# Altium project KiralyKrisztina17.PrjPcb
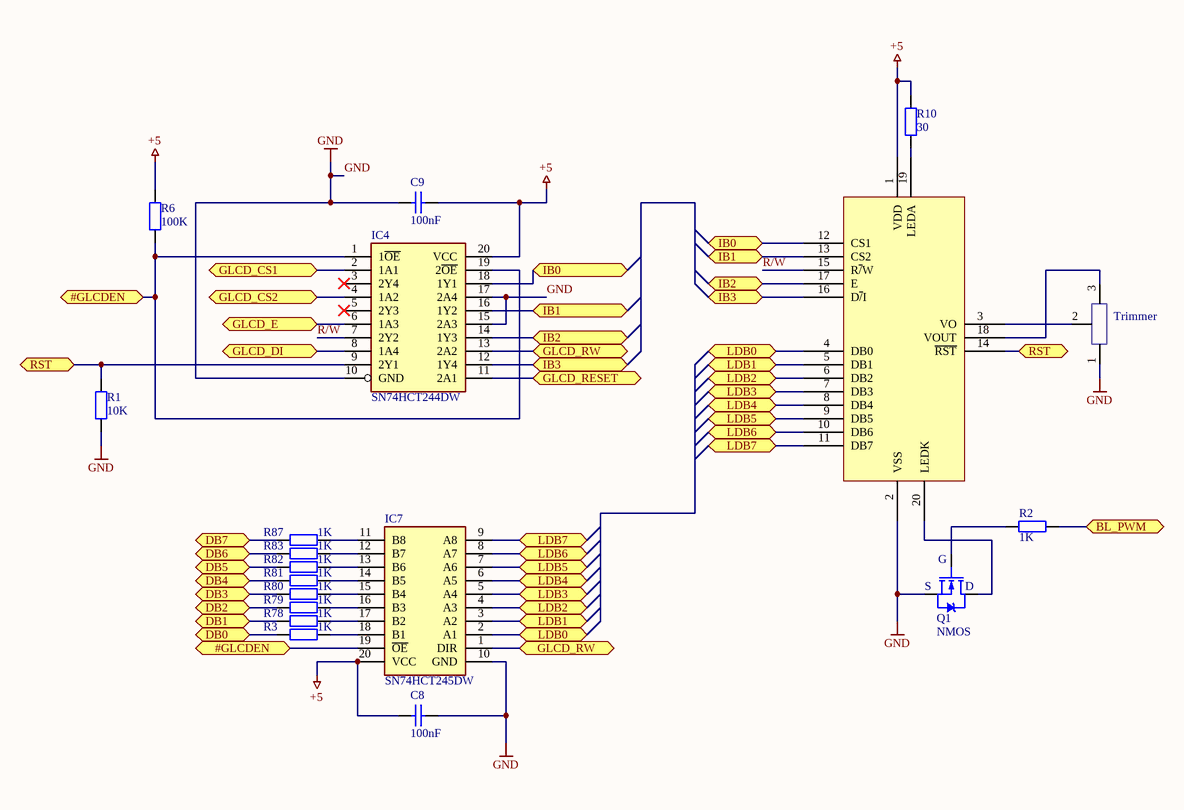
[diagram p0: LCD_screen.SchDoc]
4 sheets, 27 parts. Net scope: flat (ports and power ports of the same name join across sheets).
Board file: F17_Kiraly_Krisztina.PcbDoc
Sheets:
  LCD_screen.SchDoc
  Buttons.SchDoc
  Nucleo.SchDoc
  Power.SchDoc

## Sheet LCD_screen.SchDoc: LCD illeszteszése
size A4; Author: Király Krisztina; Organization: BME-AUT; DocumentNumber: 1; Revision: 17; SheetNumber: 1; SheetTotal: 4

### Parts
BC817  LCD Screen  [FP_LCD]  (value not drawn)
C8  100nF  [FP_0805_CAP_085]
C9  100nF  [FP_0805_CAP_085]
IC4  SN74HCT244DW  [SOIC127P1030X265-20N]
IC7  SN74HCT245DW  [SOIC127P1030X265-20N]
Q1  NMOS  [FP_SOT23-3]
R1  10K  [FP_0805_RES]
R2  1K  [FP_0805_RES]
R3  1K  [FP_0805_RES]
R6  100K  [FP_0805_RES]
R10  30  [FP_0805_RES]
R78  1K  [FP_0805_RES]
R79  1K  [FP_0805_RES]
R80  1K  [FP_0805_RES]
R81  1K  [FP_0805_RES]
R82  1K  [FP_0805_RES]
R83  1K  [FP_0805_RES]
R87  1K  [FP_0805_RES]
Trimmer  (no value)  [TRIM_3362P-1-502]

### Ports
#GLCDEN (bidir), BL_PWM (bidir), DB0 (bidir), DB1 (bidir), DB2 (bidir), DB3 (bidir), DB4 (bidir), DB5 (bidir), DB6 (bidir), DB7 (bidir), GLCD_CS1 (bidir), GLCD_CS2 (bidir), GLCD_DI (bidir), GLCD_E (bidir), GLCD_RESET (bidir), GLCD_RW (bidir), IB0 (bidir), IB1 (bidir), IB2 (bidir), IB3 (bidir), LDB0 (bidir), LDB1 (bidir), LDB2 (bidir), LDB3 (bidir), LDB4 (bidir), LDB5 (bidir), LDB6 (bidir), LDB7 (bidir), RST (bidir)

### Nets
+5: BC817.1(VDD) C8.1 C9.2 IC4.20(VCC) IC7.20(VCC) R6.2 R10.2
GND: BC817.2(VSS) C8.2 C9.1 IC4.10(GND) IC4.15(2A3) IC4.17(2A4) IC7.10(GND) Q1.3(S) R1.1 Trimmer.1
R/W: BC817.15(R~{/}W) IC4.7(2Y2)
NetBC817_3: BC817.3(VO) Trimmer.2
NetBC817_4: BC817.4(DB0) IC7.2(A1) ; port LDB0
NetBC817_5: BC817.5(DB1) IC7.3(A2) ; port LDB1
NetBC817_6: BC817.6(DB2) IC7.4(A3) ; port LDB2
NetBC817_7: BC817.7(DB3) IC7.5(A4) ; port LDB3
NetBC817_8: BC817.8(DB4) IC7.6(A5) ; port LDB4
NetBC817_9: BC817.9(DB5) IC7.7(A6) ; port LDB5
NetBC817_10: BC817.10(DB6) IC7.8(A7) ; port LDB6
NetBC817_11: BC817.11(DB7) IC7.9(A8) ; port LDB7
NetBC817_12: BC817.12(CS1) IC4.18(1Y1) ; port IB0
NetBC817_13: BC817.13(CS2) IC4.16(1Y2) ; port IB1
NetBC817_14: BC817.14(~{RST}) IC4.9(2Y1) R1.2 ; port RST
NetBC817_16: BC817.16(D~{/}I) IC4.12(1Y4) ; port IB3
NetBC817_17: BC817.17(E) IC4.14(1Y3) ; port IB2
NetBC817_18: BC817.18(VOUT) Trimmer.3
NetBC817_19: BC817.19(LEDA) R10.1
NetBC817_20: BC817.20(LEDK) Q1.2(D)
NetIC4_1: IC4.1(1~{OE}) IC4.19(2~{OE}) IC7.19(~{OE}) R6.1 ; port #GLCDEN
NetIC4_2: IC4.2(1A1) ; port GLCD_CS1
NetIC4_4: IC4.4(1A2) ; port GLCD_CS2
NetIC4_6: IC4.6(1A3) ; port GLCD_E
NetIC4_8: IC4.8(1A4) ; port GLCD_DI
NetIC4_11: IC4.11(2A1) ; port GLCD_RESET
NetIC4_13: IC4.13(2A2) IC7.1(DIR) ; port GLCD_RW
NetIC7_11: IC7.11(B8) R87.2
NetIC7_12: IC7.12(B7) R83.2
NetIC7_13: IC7.13(B6) R82.2
NetIC7_14: IC7.14(B5) R81.2
NetIC7_15: IC7.15(B4) R80.2
NetIC7_16: IC7.16(B3) R79.2
NetIC7_17: IC7.17(B2) R78.2
NetIC7_18: IC7.18(B1) R3.2
NetQ1_1: Q1.1(G) R2.1
NetR2_2: R2.2 ; port BL_PWM
NetR3_1: R3.1 ; port DB0
NetR78_1: R78.1 ; port DB1
NetR79_1: R79.1 ; port DB2
NetR80_1: R80.1 ; port DB3
NetR81_1: R81.1 ; port DB4
NetR82_1: R82.1 ; port DB5
NetR83_1: R83.1 ; port DB6
NetR87_1: R87.1 ; port DB7

Not connected (* = marked no-connect by the designer): IC4 3(2Y4)* 5(2Y3)*

### Notes on the sheet
- (near Q1) S
- (near Q1) G
- (near Q1) D
- Title
- Size:
- Date:
- A4
- Number:
- Time:
- Revision:
- Sheet
- of
- File:

### Library data of the parts
BC817 = LCD Screen: Reference: TME; Name: RG12864A-BIW-V; Supplier: Tanszék
C8 C9 = CAP: Capacitor; Name: 100nF 0805 10% 50V X7R 0805B104K500NT (FNG); Supplier: Lomex; Reference: 82-13-46; Value: 100nF
IC4 = SN74HCT244DW: Integrated Circuit; Manufacturer_Name: Texas Instruments; Name: TEXAS INSTRUMENTS SN74HCT244DWR; Reference: 3006172; Datasheet Link: http://www.ti.com/lit/ds/symlink/sn74hct244.pdf; Height: 2.65mm; Manufacturer_Part_Number: SN74HCT244DW; Mouser Part Number: 595-SN74HCT244DW; Mouser Price/Stock: https://www.mouser.co.uk/ProductDetail/Texas-Instruments/SN74HCT244DW?qs=8yeEWhuAOtPaf02S2l6zdA%3D%3D; Arrow Part Number: SN74HCT244DW; Arrow Price/Stock: https://www.arrow.com/en/products/sn74hct244dw/texas-instruments?region=nac; Supplier: Farnell
IC7 = SN74HCT245DW: Integrated Circuit; Manufacturer_Name: Texas Instruments; Name: 74HCT245D (NXP) 8xBIDIRECTIONAL BUS TRANSCEIVER 3-STATE OUTPUT SO-20 WIDE; Datasheet Link: http://www.ti.com/lit/ds/symlink/sn74hct245.pdf; Height: 2.65mm; Manufacturer_Part_Number: SN74HCT245DW; Mouser Part Number: 595-SN74HCT245DW; Mouser Price/Stock: https://www.mouser.co.uk/ProductDetail/Texas-Instruments/SN74HCT245DW?qs=5h8QSfodyRguwsnqzMvAgw%3D%3D; Arrow Part Number: SN74HCT245DW; Arrow Price/Stock: https://www.arrow.com/en/products/sn74hct245dw/texas-instruments?region=nac; Supplier: Lomex; Reference: 87-06-35
Q1 = NMOS: NXP - BSP030,115 - MOSFET, N CH, 30V, 10A, SOT223; pin to pad: 2>3 3>2; Name: 2N7002 (NXP) N-FET 60V 0.3A 0.83W Rds<5R SOT-23 ˝12W˝ (SN7002); Supplier: Lomex; Reference: 86-00-97
R1 = RES: Resistor; Name: 10K0 0805 5% RS-05K103JT 0.125W (FNG); Supplier: Lomex; Reference: 81-35-05; Value: 10K
R2 R3 R78-R83 R87 = RES: Resistor; Name: 1K00 0805 5% CR-05JL7----1K 0.125W (VIK); Supplier: Lomex; Reference: 81-10-87; Value: 1K
R6 = RES: Resistor; Name: 100K 0805 5% CR-05JL7--100K 0.125W (VIK); Supplier: Lomex; Reference: 81-11-11; Value: 100K
R10 = RES: Resistor; Name: 30R0 0805 5% WR08X300JTL 0.125W (WAL); Supplier: Lomex; Reference: 81-29-89; Value: 30
Trimmer = Trimmer: Name: 5K00 3362P-502R (KIC) 6.6x7mm 1#-1# CERMET FEKVÖ; Supplier: Lomex; Reference: 05-06-68; Max value: *; Min value: *

## Sheet Buttons.SchDoc: Gomb illesztések
size A4; DocumentNumber: 2; SheetNumber: 2; SheetTotal: 4
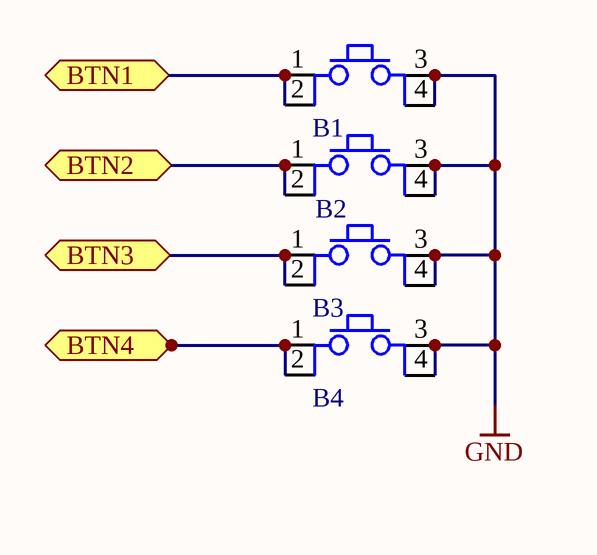
[diagram p1: Buttons.SchDoc]

### Parts
B1  Button  [FP_BTN_SMD]  (value not drawn)
B2  Button  [FP_BTN_SMD]  (value not drawn)
B3  Button  [FP_BTN_SMD]  (value not drawn)
B4  Button  [FP_BTN_SMD]  (value not drawn)

### Ports
BTN1 (bidir), BTN2 (bidir), BTN3 (bidir), BTN4 (bidir)

### Nets
GND: B1.3 B1.4 B2.3 B2.4 B3.3 B3.4 B4.3 B4.4
NetB1_1: B1.1 B1.2 ; port BTN1
NetB2_1: B2.1 B2.2 ; port BTN2
NetB3_1: B3.1 B3.2 ; port BTN3
NetB4_1: B4.1 B4.2 ; port BTN4

### Notes on the sheet
- Title
- Size:
- Date:
- A4
- Number:
- Time:
- Revision:
- Sheet
- of
- File:

### Library data of the parts
B1-B4 = Button 4P: Push button; Reference: 2610937; Name: ALCOSWITCH - TE CONNECTIVITY FSM1LPTR; Supplier: Farnell

## Sheet Nucleo.SchDoc: Mikrokontroller összekötései
size A4; Author: Király Krisztina; Organization: BME-AUT; DocumentNumber: 3; Revision: 17; SheetNumber: 3; SheetTotal: 4
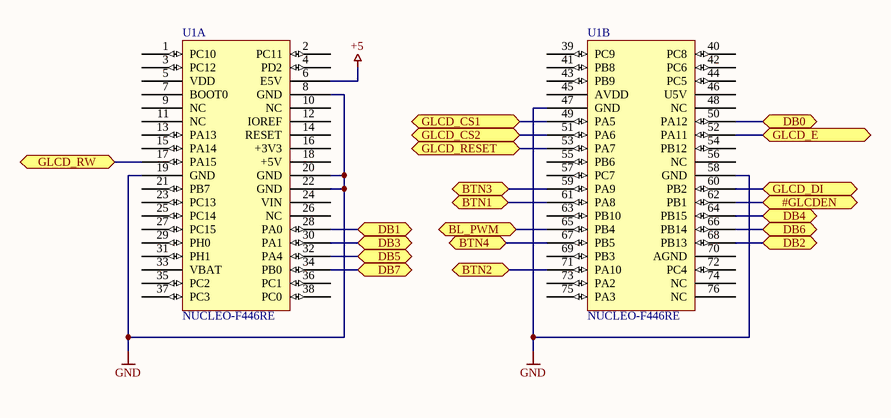
[diagram p2: Nucleo.SchDoc]

### Parts
U1  NUCLEO-F446RE  [FP_NUCLEO-64_2x20]  (parts A,B of 2)

### Ports
#GLCDEN (bidir), BL_PWM (bidir), BTN1 (bidir), BTN2 (bidir), BTN3 (bidir), BTN4 (bidir), DB0 (bidir), DB1 (bidir), DB2 (bidir), DB3 (bidir), DB4 (bidir), DB5 (bidir), DB6 (bidir), DB7 (bidir), GLCD_CS1 (bidir), GLCD_CS2 (bidir), GLCD_DI (bidir), GLCD_E (bidir), GLCD_RESET (bidir), GLCD_RW (bidir)

### Nets
+5: U1.6(E5V)
GND: U1.8(GND) U1.19(GND) U1.20(GND) U1.22(GND) U1.47(GND) U1.58(GND)
NetB1_1: U1.61(PA8) ; port BTN1
NetB2_1: U1.71(PA10) ; port BTN2
NetB3_1: U1.59(PA9) ; port BTN3
NetB4_1: U1.67(PB5) ; port BTN4
NetIC4_1: U1.62(PB1) ; port #GLCDEN
NetIC4_2: U1.49(PA5) ; port GLCD_CS1
NetIC4_4: U1.51(PA6) ; port GLCD_CS2
NetIC4_6: U1.52(PA11) ; port GLCD_E
NetIC4_8: U1.60(PB2) ; port GLCD_DI
NetIC4_11: U1.53(PA7) ; port GLCD_RESET
NetIC4_13: U1.17(PA15) ; port GLCD_RW
NetR2_2: U1.65(PB4) ; port BL_PWM
NetR3_1: U1.50(PA12) ; port DB0
NetR78_1: U1.28(PA0) ; port DB1
NetR79_1: U1.68(PB13) ; port DB2
NetR80_1: U1.30(PA1) ; port DB3
NetR81_1: U1.64(PB15) ; port DB4
NetR82_1: U1.32(PA4) ; port DB5
NetR83_1: U1.66(PB14) ; port DB6
NetR87_1: U1.34(PB0) ; port DB7

Not connected (* = marked no-connect by the designer): U1 1(PC10) 2(PC11) 3(PC12) 4(PD2) 5(VDD) 7(BOOT0) 9(NC) 10(NC) 11(NC) 12(IOREF) 13(PA13) 14(RESET) 15(PA14) 16(+3V3) 18(+5V) 21(PB7) 23(PC13) 24(VIN) 25(PC14) 26(NC) 27(PC15) 29(PH0) 31(PH1) 33(VBAT) 35(PC2) 36(PC1) 37(PC3) 38(PC0) 39(PC9) 40(PC8) 41(PB8) 42(PC6) 43(PB9) 44(PC5) 45(AVDD) 46(U5V) 48(NC) 54(PB12) 55(PB6) 56(NC) 57(PC7) 63(PB10) 69(PB3) 70(AGND) 72(PC4) 73(PA2) 74(NC) 75(PA3) 76(NC)

### Notes on the sheet
- Title
- Size:
- Date:
- A4
- Number:
- Time:
- Revision:
- Sheet
- of
- File:

### Library data of the parts
U1 = NUCLEO-F446RE: Reference: NUCLEO; Name: Nucleo F446RE; Supplier: Tanszék

## Sheet Power.SchDoc: 5V os táp csatlakozó
size A4; Author: Király Krisztina; Organization: BME-AUT; DocumentNumber: 4; Revision: 17; SheetNumber: 4; SheetTotal: 4
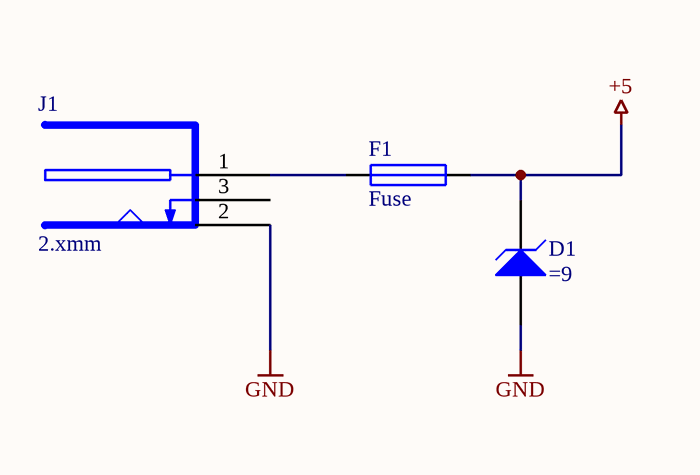
[diagram p3: Power.SchDoc]

### Parts
D1  (no value)  [FP_SMA]
F1  Fuse  [FP_MULTIFUSE]
J1  2.xmm  [FP_DC_TAP_ANYA]

### Nets
+5: D1.2(K) F1.2
GND: D1.1(A) J1.2(SLEEVE)
NetF1_1: F1.1 J1.1(PIN)

Not connected (* = marked no-connect by the designer): J1 3(BREAK)

### Notes on the sheet
- Title
- Size:
- Date:
- A4
- Number:
- Time:
- Revision:
- Sheet
- of
- File:

### Library data of the parts
D1 = ZENER: Zener Diode; U_Z: 24; Reference: 9550941; Name: VISHAY SMAJ5.0A-E3/61; Supplier: Farnell
F1 = Fuse: Name: 1.1A 33V 1812L110/33MR POLYFUSE SMD 1812 (LFS) ˝LF110-33˝; Reference: 44-03-25; Supplier: Lomex
J1 = DC_TAP_ANYA: 2.xmm DC HEBA25 TÁPFESZÜLTSÉG ALJZAT ZÁRT, NYÁKBA 90°; Name: TÁP DC ANYA 5.5/2.1/9.5mm DCS-5521-5; Supplier: Lomex; Reference: 43-07-67

## Nets that join several sheets
+5: LCD_screen (7 pins), Nucleo (U1.6), Power (D1.2 F1.2)
GND: LCD_screen (10 pins), Buttons (8 pins), Nucleo (6 pins), Power (D1.1 J1.2)
NetB1_1: Buttons (B1.1 B1.2), Nucleo (U1.61)
NetB2_1: Buttons (B2.1 B2.2), Nucleo (U1.71)
NetB3_1: Buttons (B3.1 B3.2), Nucleo (U1.59)
NetB4_1: Buttons (B4.1 B4.2), Nucleo (U1.67)
NetIC4_1: LCD_screen (IC4.1 IC4.19 IC7.19 R6.1), Nucleo (U1.62)
NetIC4_2: LCD_screen (IC4.2), Nucleo (U1.49)
NetIC4_4: LCD_screen (IC4.4), Nucleo (U1.51)
NetIC4_6: LCD_screen (IC4.6), Nucleo (U1.52)
NetIC4_8: LCD_screen (IC4.8), Nucleo (U1.60)
NetIC4_11: LCD_screen (IC4.11), Nucleo (U1.53)
NetIC4_13: LCD_screen (IC4.13 IC7.1), Nucleo (U1.17)
NetR2_2: LCD_screen (R2.2), Nucleo (U1.65)
NetR3_1: LCD_screen (R3.1), Nucleo (U1.50)
NetR78_1: LCD_screen (R78.1), Nucleo (U1.28)
NetR79_1: LCD_screen (R79.1), Nucleo (U1.68)
NetR80_1: LCD_screen (R80.1), Nucleo (U1.30)
NetR81_1: LCD_screen (R81.1), Nucleo (U1.64)
NetR82_1: LCD_screen (R82.1), Nucleo (U1.32)
NetR83_1: LCD_screen (R83.1), Nucleo (U1.66)
NetR87_1: LCD_screen (R87.1), Nucleo (U1.34)